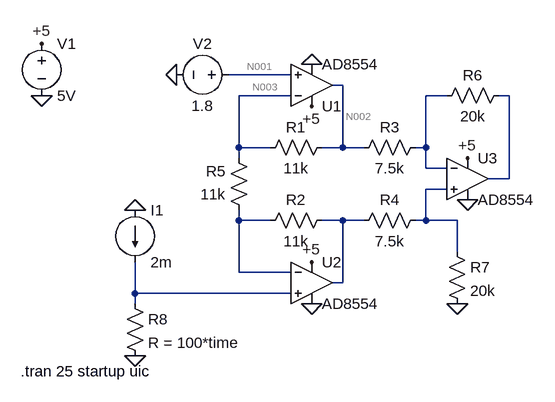
[diagram p0: schematic GeoSense_LTspice_1k.asc]
GeoSense_LTspice_1k.asc, the LTspice schematic file:
Version 4
SHEET 1 880 680
WIRE 96 96 0 96
WIRE 176 112 160 112
WIRE 96 128 16 128
WIRE 336 128 304 128
WIRE 432 128 416 128
WIRE 16 208 16 128
WIRE 64 208 16 208
WIRE 176 208 176 112
WIRE 176 208 144 208
WIRE 208 208 176 208
WIRE 304 208 304 128
WIRE 304 208 288 208
WIRE 16 224 16 208
WIRE 304 240 304 208
WIRE 336 240 304 240
WIRE 432 256 432 128
WIRE 432 256 400 256
WIRE 336 272 304 272
WIRE 16 320 16 304
WIRE 64 320 16 320
WIRE 176 320 144 320
WIRE 208 320 176 320
WIRE 304 320 304 272
WIRE 304 320 288 320
WIRE 352 320 304 320
WIRE 352 368 352 320
WIRE 16 400 16 320
WIRE 96 400 16 400
WIRE 176 416 176 320
WIRE 176 416 160 416
WIRE -144 432 -144 384
WIRE 96 432 -144 432
WIRE -144 448 -144 432
FLAG 128 448 0
FLAG 128 80 0
FLAG 368 288 0
FLAG -288 128 0
FLAG 128 144 +5
FLAG 128 384 +5
FLAG 368 224 +5
FLAG -144 528 0
FLAG -144 304 0
FLAG -80 96 0
FLAG 352 448 0
FLAG -288 48 +5
SYMBOL OpAmps\\AD8554 128 176 M180
SYMATTR InstName U1
SYMBOL OpAmps\\AD8554 128 352 R0
SYMATTR InstName U2
SYMBOL OpAmps\\AD8554 368 192 R0
SYMATTR InstName U3
SYMBOL voltage -288 32 R0
WINDOW 123 0 0 Left 0
WINDOW 39 0 0 Left 0
SYMATTR InstName V1
SYMATTR Value 5V
SYMBOL res 160 192 R90
WINDOW 0 0 56 VBottom 2
WINDOW 3 32 56 VTop 2
SYMATTR InstName R1
SYMATTR Value 11k
SYMBOL res 160 304 R90
WINDOW 0 0 56 VBottom 2
WINDOW 3 32 56 VTop 2
SYMATTR InstName R2
SYMATTR Value 11k
SYMBOL res 304 192 R90
WINDOW 0 0 56 VBottom 2
WINDOW 3 32 56 VTop 2
SYMATTR InstName R3
SYMATTR Value 7.5k
SYMBOL res 304 304 R90
WINDOW 0 0 56 VBottom 2
WINDOW 3 32 56 VTop 2
SYMATTR InstName R4
SYMATTR Value 7.5k
SYMBOL res 32 320 R180
WINDOW 0 36 76 Left 2
WINDOW 3 36 40 Left 2
SYMATTR InstName R5
SYMATTR Value 11k
SYMBOL res 320 144 R270
WINDOW 0 32 56 VTop 2
WINDOW 3 0 56 VBottom 2
SYMATTR InstName R6
SYMATTR Value 20k
SYMBOL res 336 352 R0
SYMATTR InstName R7
SYMATTR Value 20k
SYMBOL res -160 432 R0
SYMATTR InstName R8
SYMATTR Value R = 100*time
SYMBOL current -144 304 R0
WINDOW 123 0 0 Left 0
WINDOW 39 0 0 Left 0
SYMATTR InstName I1
SYMATTR Value 2m
SYMBOL voltage 16 96 R90
WINDOW 0 -32 56 VBottom 2
WINDOW 3 32 56 VTop 2
WINDOW 123 0 0 Left 0
WINDOW 39 0 0 Left 0
SYMATTR InstName V2
SYMATTR Value 1.8
TEXT -320 552 Left 2 !.tran 25 startup uic

The netlist it stands for:
* GeoSense_LTspice_1k.asc
XU1 N001 N003 +5 0 N002 AD8554  ; pins In+ In- V+ V- OUT
XU2 N009 N007 +5 0 N008 AD8554  ; pins In+ In- V+ V- OUT
XU3 N006 N004 +5 0 N005 AD8554  ; pins In+ In- V+ V- OUT
V1 +5 0 5V
R1 N002 N003 11k
R2 N008 N007 11k
R3 N004 N002 7.5k
R4 N006 N008 7.5k
R5 N007 N003 11k
R6 N004 N005 20k
R7 N006 0 20k
R8 N009 0 R = 100*time
I1 0 N009 2m
V2 N001 0 1.8
.tran 25 startup uic
.backanno
.end

* Results of the author's LTspice run, read from the files saved beside the schematic
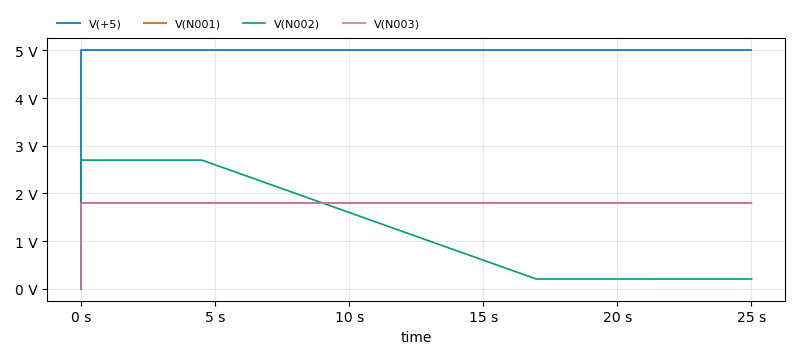
[diagram p1: Transient Analysis of GeoSense_LTspice_1k.asc, plotted from the saved traces]
* Transient Analysis, 1 run:
*   V(+5): min 0 V, max 5 V, average 5 V, rms 5 V, last 5 V
*   V(N001): min 0 V, max 1.8 V, average 1.8 V, rms 1.8 V, last 1.8 V
*   V(N002): min 0 V, max 2.699 V, average 1.277 V, rms 1.635 V, last 205.8 mV
*   V(N003): min 0 V, max 1.8 V, average 1.8 V, rms 1.8 V, last 1.8 V